# EAGLE design decrementeur3b (EAGLE 6.3)
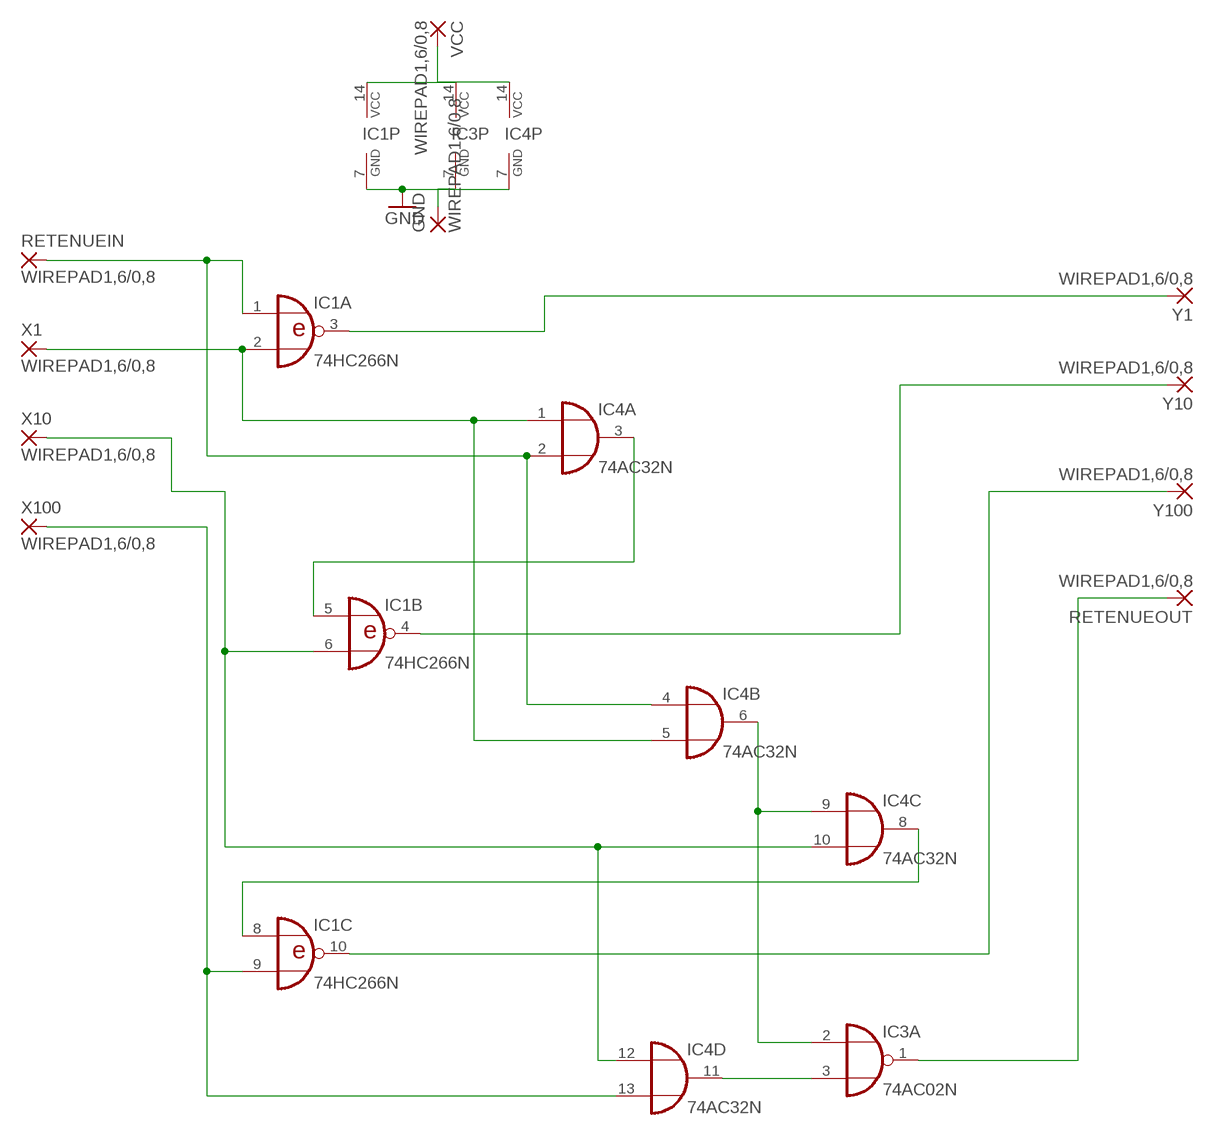
[diagram p0: schematic, sheet 1]

## Parts
GND  WIREPAD1,6/0,8  [1,6/0,8]
IC1  74HC266N  [DIL14]
IC3  74AC02N  [DIL14]
IC4  74AC32N  [DIL14]
RETENUEIN  WIREPAD1,6/0,8  [1,6/0,8]
RETENUEOUT  WIREPAD1,6/0,8  [1,6/0,8]
VCC  WIREPAD1,6/0,8  [1,6/0,8]
X1  WIREPAD1,6/0,8  [1,6/0,8]
X10  WIREPAD1,6/0,8  [1,6/0,8]
X100  WIREPAD1,6/0,8  [1,6/0,8]
Y1  WIREPAD1,6/0,8  [1,6/0,8]
Y10  WIREPAD1,6/0,8  [1,6/0,8]
Y100  WIREPAD1,6/0,8  [1,6/0,8]

## Nets
GND: GND.1(P) IC1.7(P:GND) IC3.7(P:GND) IC4.7(P:GND)
N$1: IC1.2(A:I1) IC4.1(A:I0) IC4.5(B:I1) X1.1(P)
N$2: IC1.1(A:I0) IC4.2(A:I1) IC4.4(B:I0) RETENUEIN.1(P)
N$3: IC1.3(A:O) Y1.1(P)
N$4: IC3.2(A:I0) IC4.6(B:O) IC4.9(C:I0)
N$5: IC1.8(C:I0) IC4.8(C:O)
N$6: IC1.9(C:I1) IC4.13(D:I1) X100.1(P)
N$7: IC1.6(B:I1) IC4.10(C:I1) IC4.12(D:I0) X10.1(P)
N$8: IC1.5(B:I0)
N$9: IC1.10(C:O) Y100.1(P)
N$10: IC1.4(B:O) Y10.1(P)
N$11: IC3.3(A:I1) IC4.11(D:O)
N$12: IC3.1(A:O) RETENUEOUT.1(P)
VCC: IC1.14(P:VCC) IC3.14(P:VCC) IC4.14(P:VCC) VCC.1(P)
Unconnected: IC1.11(D:O) IC1.12(D:I0) IC1.13(D:I1) IC3.4(B:O) IC3.5(B:I0) IC3.6(B:I1) IC3.8(C:I0) IC3.9(C:I1) IC3.10(C:O) IC3.11(D:I0) IC3.12(D:I1) IC3.13(D:O) IC4.3(A:O)

## Library data of the parts
GND RETENUEIN RETENUEOUT VCC X1 X10 X100 Y1 Y10 Y100 = wirepad:WIREPAD: Wire PAD connect wire on PCB
IC1 = 74xx-eu:74*266: Quadruple EXCLUSIVE-NOR (XNOR), open-collector
IC3 = 74xx-eu:74*02: Quad 2-input NOR gate
IC4 = 74xx-eu:74*32: Quad 2-input OR gate

## Board
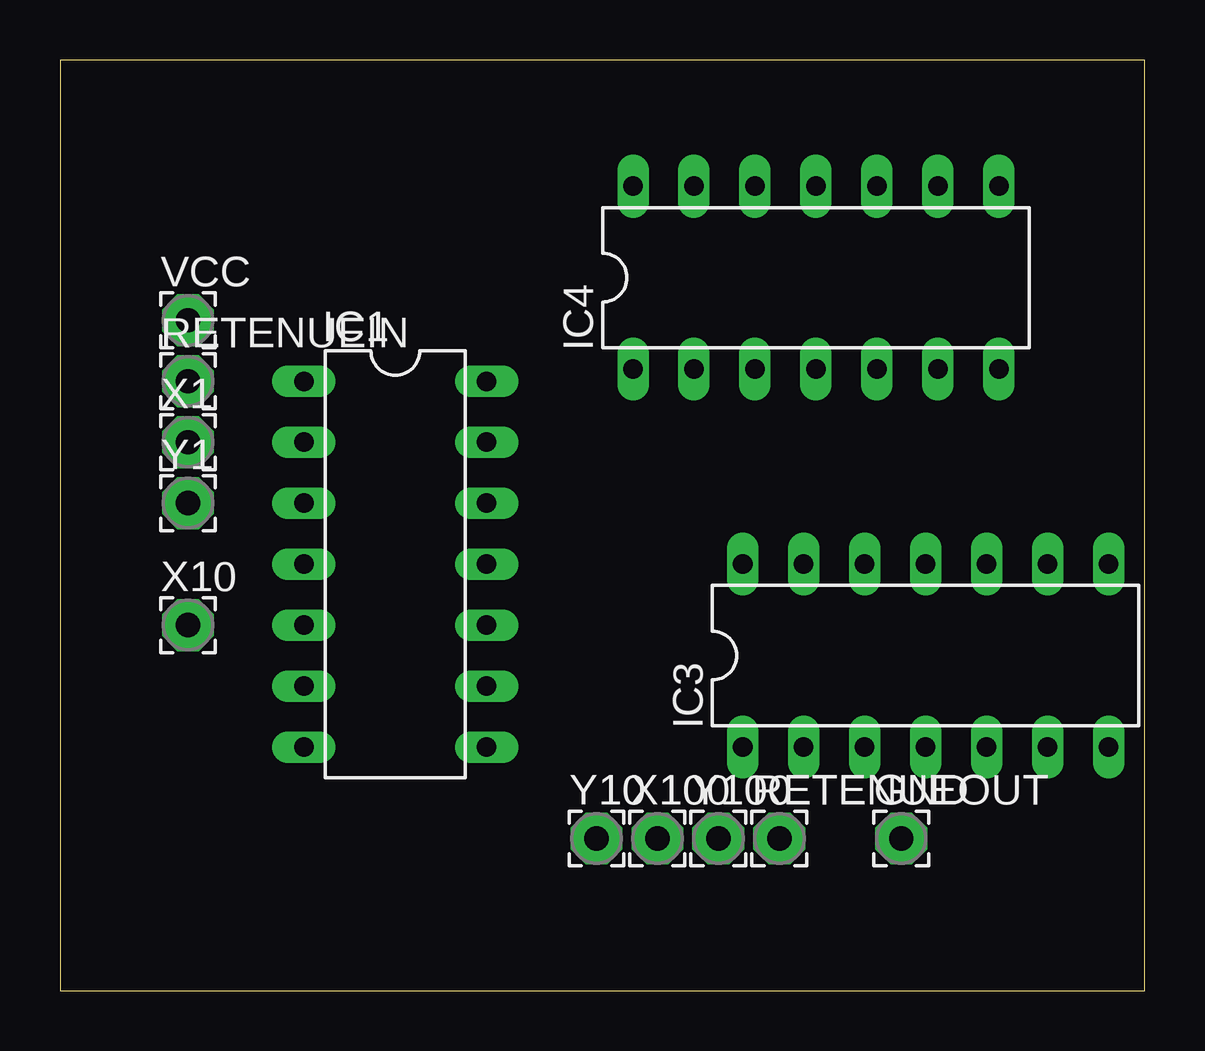
[diagram p1: board, top side]
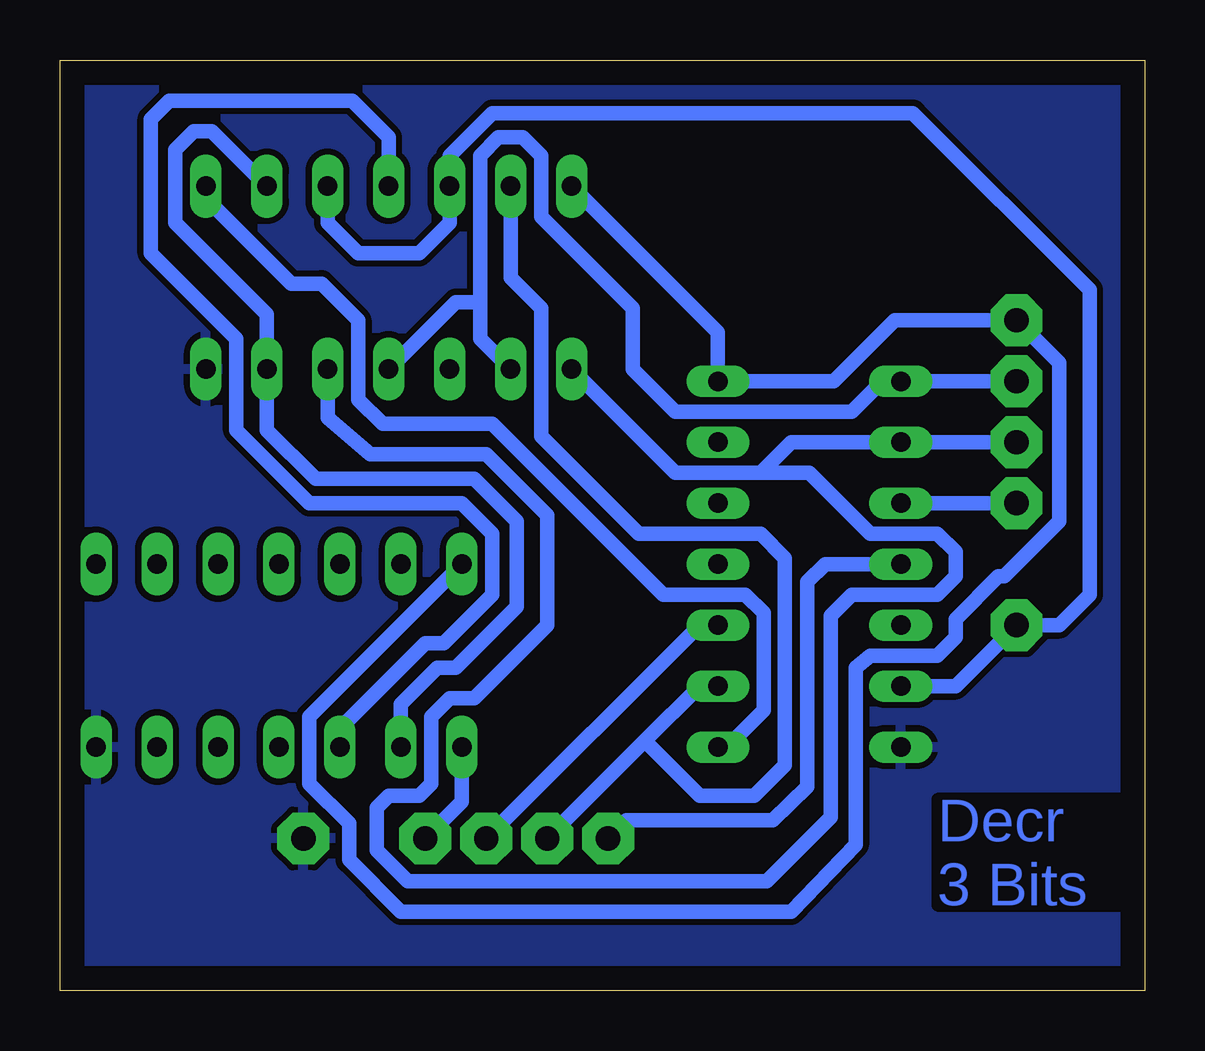
[diagram p2: board, bottom side, seen from below]

Size 45.19 x 38.79 mm. Coordinates in mm from the lower left corner, seen from the top.
Outline: 0,0 45.19,0 45.19,38.79 0,38.79 0,0
Copper layers (1*16): Top 0.035mm / dielectric 1.5mm / Bottom 0.035mm
Design rules "default *": minimum track width 10mil, minimum drill 24mil, track to track 10mil, track to pad 10mil, pad to pad 10mil, via to via 10mil, smd to smd 10mil, copper to edge 40mil, drill to drill 10mil, minimum pad ring 10mil, minimum via ring 8mil, stop-mask expansion 4mil, vias tented up to drill 0mil, thermal gap 10mil

### Footprints (pad centres in the part's own frame; a part is rotated, then mirrored left to right if it is on the bottom)
2,15/1,0 = drill 1.016 pad 2.159 octagon: 1 0,0
DIL14 = drill 0.813 long: 1 -7.62,-3.81; 2 -5.08,-3.81; 3 -2.54,-3.81; 4 0,-3.81; 5 2.54,-3.81; 6 5.08,-3.81; 7 7.62,-3.81; 8 7.62,3.81; 9 5.08,3.81; 10 2.54,3.81; 11 0,3.81; 12 -2.54,3.81; 13 -5.08,3.81; 14 -7.62,3.81

### Placement (x,y rotation side)
GND  WIREPAD2,15/1,0  [2,15/1,0]  35.05,6.35 0 top
IC1  13.97,17.78 270 top
IC3  36.07,13.97 0 top
IC4  31.5,29.72 0 top
RETENUEIN  WIREPAD2,15/1,0  [2,15/1,0]  5.33,25.4 0 top
RETENUEOUT  WIREPAD2,15/1,0  [2,15/1,0]  29.97,6.35 0 top
VCC  WIREPAD2,15/1,0  [2,15/1,0]  5.33,27.94 0 top
X1  WIREPAD2,15/1,0  [2,15/1,0]  5.33,22.86 0 top
X10  WIREPAD2,15/1,0  [2,15/1,0]  5.33,15.24 0 top
X100  WIREPAD2,15/1,0  [2,15/1,0]  24.89,6.35 0 top
Y1  WIREPAD2,15/1,0  [2,15/1,0]  5.33,20.32 0 top
Y10  WIREPAD2,15/1,0  [2,15/1,0]  22.35,6.35 0 top
Y100  WIREPAD2,15/1,0  [2,15/1,0]  27.43,6.35 0 top

### Tracks (layer width: path | path; a pad name or v marks a point on that pad's centre or on a via)
GND
  pour Bottom: -1.52,39.62 46.74,39.37 46.74,-1.02 -1.52,-0.76
N$1
  Bottom 0.61: X1.1 IC1.2 14.73,22.86 16,21.59 | IC4.5 34.04,23.88 32.26,22.35 27.43,22.35 24.89,19.81 24.89,15.24 27.94,12.19 28.96,12.19 29.72,11.43 29.72,8.64 30.23,8.13 31.5,8.13 32,7.62 32,5.87 30.71,4.57 15.75,4.57 13.08,7.24 13.08,15.62 12.19,16.51 8.64,16.51 7.87,17.27 7.87,18.29 8.64,19.05 11.43,19.05 13.97,21.59 16,21.59 | IC4.1 19.56,21.59 16,21.59
N$2
  Bottom 0.61: RETENUEIN.1 IC1.1 10.92,25.4 12.19,24.13 19.56,24.13 21.34,25.91 21.34,28.45 25.15,32.26 25.15,34.8 25.91,35.56 26.92,35.56 27.69,34.8 27.69,28.7 | IC4.2 27.69,27.18 27.69,28.7 | 27.69,28.7 28.7,28.7 IC4.4
N$3
  Bottom 0.61: IC1.3 Y1.1
N$4
  Bottom 0.61: IC4.9 38.86,35.81 39.62,35.81 40.39,35.05 40.39,32 36.58,28.19 IC4.6 36.58,23.37 34.54,21.34 27.94,21.34 26.16,19.56 26.16,16 28.7,13.46 29.46,13.46 30.99,11.94 IC3.2
N$5
  Bottom 0.61: IC1.8 17.53,10.41 17.15,10.41 15.88,11.68 15.88,15.75 16.64,16.51 20.07,16.51 27.18,23.62 31.75,23.62 32.77,24.64 32.77,27.94 34.29,29.46 35.56,29.46 39.12,33.02 IC4.8
N$6
  Bottom 0.61: IC1.9 18.54,12.7 20.83,10.41 | 20.83,10.41 X100.1 | 20.83,10.41 18.54,8.13 16.26,8.13 14.99,9.4 14.99,18.03 16,19.05 21.08,19.05 25.15,23.11 25.15,28.45 26.42,29.72 IC4.13
N$7
  Bottom 0.61: IC4.10 34.04,32 32.77,30.73 30.23,30.73 28.96,32 IC4.12 28.96,34.8 27.18,36.58 9.65,36.58 2.29,29.21 2.29,16.51 3.56,15.24 X10.1 7.87,12.7 IC1.6
N$9
  Bottom 0.61: IC1.10 18.54,15.24 Y100.1
N$10
  Bottom 0.61: IC1.4 13.31,17.78 14.05,17.04 14.05,8.51 15.49,7.11 21.59,7.11 Y10.1
N$11
  Bottom 0.61: IC4.11 31.5,35.56 33.02,37.08 40.64,37.08 41.4,36.32 41.4,30.73 37.85,27.18 37.85,23.37 34.8,20.32 28.45,20.32 27.18,19.05 27.18,16.51 29.21,14.48 29.97,14.48 32.51,11.94 33.53,10.92 IC3.3
N$12
  Bottom 0.61: IC3.1 28.45,7.87 RETENUEOUT.1
VCC
  Bottom 0.61: IC4.14 17.78,27.43 IC1.14 12.95,25.4 10.41,27.94 VCC.1 3.56,26.16 3.56,19.56 5.84,17.27 6.1,17.27 7.87,15.49 7.87,14.73 8.64,13.97 11.43,13.97 12.04,13.46 12.04,6.1 14.73,3.3 30.99,3.3 33.15,5.46 33.15,6.99 34.8,8.64 34.8,11.43 IC3.14

### Text on the board
Bottom: Decr / 3 Bits